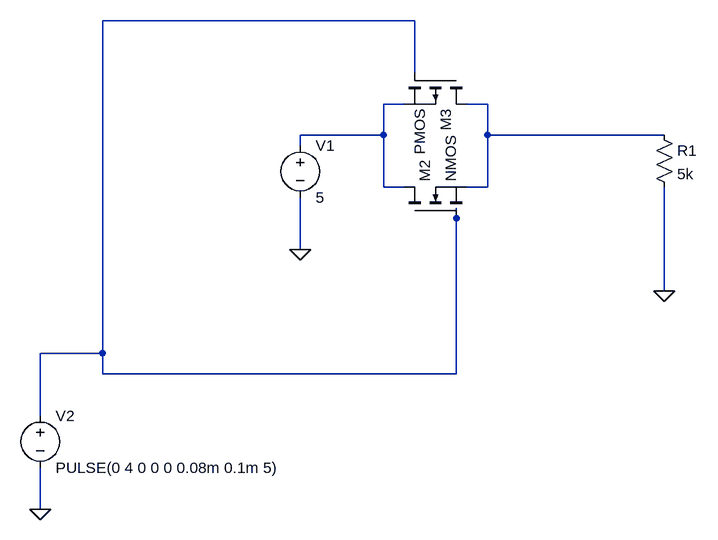
[diagram p0: schematic Draft8.asc]
Draft8.asc, the LTspice schematic file:
Version 4
SHEET 1 880 864
WIRE 144 96 -336 96
WIRE 144 176 144 96
WIRE 128 224 96 224
WIRE 256 224 224 224
WIRE 96 272 96 224
WIRE 96 272 -32 272
WIRE 256 272 256 224
WIRE 528 272 256 272
WIRE -32 288 -32 272
WIRE 96 352 96 272
WIRE 128 352 96 352
WIRE 256 352 256 272
WIRE 256 352 224 352
WIRE 208 400 208 384
WIRE -32 448 -32 368
WIRE 528 512 528 352
WIRE -336 608 -336 96
WIRE -336 608 -432 608
WIRE -336 640 -336 608
WIRE 208 640 208 400
WIRE 208 640 -336 640
WIRE -432 704 -432 608
WIRE -432 848 -432 784
FLAG -32 448 0
FLAG 528 512 0
FLAG -432 848 0
SYMBOL voltage -32 272 R0
SYMATTR InstName V1
SYMATTR Value 5
SYMBOL nmos 128 400 R270
SYMATTR InstName M2
SYMBOL pmos 224 176 R90
SYMATTR InstName M3
SYMBOL voltage -432 688 R0
SYMATTR InstName V2
SYMATTR Value PULSE(0 4 0 0 0 0.08m 0.1m 5)
SYMBOL res 512 256 R0
SYMATTR InstName R1
SYMATTR Value 5k

The netlist it stands for:
* Draft8.asc
V1 N002 0 5
M2 N002 N001 N003 N003 NMOS
M3 N003 N001 N002 N002 PMOS
V2 N001 0 PULSE(0 4 0 0 0 0.08m 0.1m 5)
R1 N003 0 5k
.model NMOS NMOS
.model PMOS PMOS
.lib standard.mos
.backanno
.end